# Altium schematic sheet C3.0-控制传感-3.0-led灯控制模块-24.10.17.SchDoc
size A4
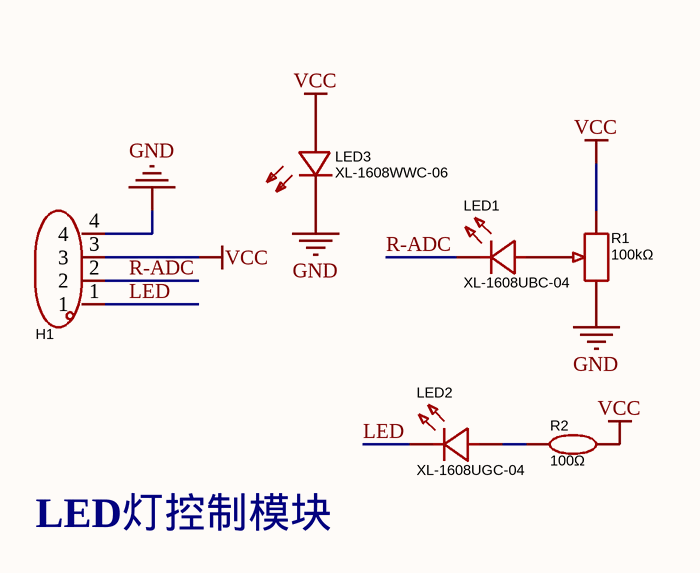
[diagram p0: C3.0-控制传感-3.0-led灯控制模块-24.10.17.SchDoc]

## Parts
H1  PZ254V-11-04P  [HDR-TH_4P-P2.54-V-M]  (value not drawn)
LED1  XL-1608UBC-04  [LED0603-RD_BLUE]
LED2  XL-1608UGC-04  [LED0603-RD_GREEN]
LED3  XL-1608WWC-06  [LED0603-RD_WHITE]
R1  100kΩ  [RES-ADJ-TH_3P-L9.5-W4.9-P2.50-L_3296W]
R2  100Ω  [R0805]

## Nets
GND: H1.4 LED3.1(C) R1.1
VCC: H1.3 LED3.2(A) R1.3 R2.2
LED: H1.1 LED2.1(K)
R-ADC: H1.2 LED1.1(K)
NetLED1_2: LED1.2(A) R1.2
NetLED2_2: LED2.2(A) R2.1

## Notes on the sheet
- LED灯控制模块

## Library data of the parts
H1 = PZ254V-11-04P: Manufacturer: XFCN(兴飞); Symbol: PZ254V-11-04P_C2691448; Add into BOM: yes; Pin Structure: 1x4P; Pitch: 2.54mm; Circluar Pins/Square Pins: 方针; Current Rating (Max): 3A; Voltage Rating (Max): 250V; Device: PZ254V-11-04P; LCSC Part Name: 间距:2.54mm 1x4P 直插 方针; Supplier Part: C2691448; Manufacturer Part: PZ254V-11-04P; Supplier Footprint: 插件,P=2.54mm; JLCPCB Part Class: Extended Part; Datasheet: https://atta.szlcsc.com/upload/public/pdf/source/20200309/C492403_F9F19131791D08044AD4F84F8E751A34.pdf; Supplier: LCSC; Convert to PCB: yes; Row Spacing: -; Mounting Type: 直插; Number of Rows: 单排; Number of Pins: 4P; Length of Mating Pin: 6mm; Insulation Height: 2.5mm; Length of End Connection Pin: 3mm; Contact Material: -; Operating Temperature Range: -40℃~+105℃; Color: 黑色; Comment_1: PZ254V-11-04P
LED1 = XL-1608UBC-04: Manufacturer: XINGLIGHT(成兴光); Add into BOM: yes; Emitted Color: 蓝色; Power Dissipation: 80mW; Forward Current: 25mA; Dominant Wavelength: 460nm~469nm; Peak Wavelength: 475nm; Lens Color: 无色透明透镜; Viewing Angle: 120°; Mounting Sytle: 正贴; Symbol: XL-1608UBC-04; Device: XL-1608UBC-04; LCSC Part Name: XL-1608UBC-04; Supplier Part: C965807; Manufacturer Part: XL-1608UBC-04; Supplier Footprint: 0603; JLCPCB Part Class: Extended Part; Datasheet: https://atta.szlcsc.com/upload/public/pdf/source/20240218/F76B043D1CDACE9DB8357580572EF0D5.pdf; Supplier: LCSC; Convert to PCB: yes; Color Temperature: -; Operating Temperature: -30℃~+85℃; Comment_1: XL-1608UBC-04
LED2 = XL-1608UGC-04: Manufacturer: XINGLIGHT(成兴光); Add into BOM: yes; Emitted Color: 翠绿色; Power Dissipation: 80mW; Forward Current: 25mA; Dominant Wavelength: 516nm~525nm; Peak Wavelength: 534nm; Diode Configuration: 独立二极管; Lens Color: 无色透明透镜; Viewing Angle: 120°; Mounting Sytle: 正贴; Symbol: XL-1608UGC-04; Device: XL-1608UGC-04; LCSC Part Name: XL-1608UGC-04; Supplier Part: C965804; Manufacturer Part: XL-1608UGC-04; Supplier Footprint: 0603; JLCPCB Part Class: Extended Part; Datasheet: https://atta.szlcsc.com/upload/public/pdf/source/20221102/520D6E465E5CFD1609C8A4DBC80D4018.pdf; Supplier: LCSC; Convert to PCB: yes; Lamp Holder Type: -; Forward Voltage (VF): -; Color Temperature: -; Luminous Intensity: -; Operating Temperature: -30℃~+85℃; Comment_1: XL-1608UGC-04
LED3 = XL-1608WWC-06: Manufacturer: XINGLIGHT(成兴光); Add into BOM: yes; Emitted Color: 白色; Forward Voltage (VF): 3.3V; Power Dissipation: 70mW; Forward Current: 20mA; Lens Color: 黄色透镜; Luminous Intensity: 780mcd; Viewing Angle: 130°; Mounting Sytle: 正贴; Symbol: xl-1608wwc-06; Device: XL-1608WWC-06; LCSC Part Name: XL-1608WWC-06; Supplier Part: C965810; Manufacturer Part: XL-1608WWC-06; Supplier Footprint: 0603; JLCPCB Part Class: Extended Part; Datasheet: https://atta.szlcsc.com/upload/public/pdf/source/20241017/E3273F0496529BA22A77FC6EB389D0BD.pdf; Supplier: LCSC; Convert to PCB: yes; Dominant Wavelength: -; Color Temperature: -; Operating Temperature: -20℃~+85℃; Comment_1: XL-1608WWC-06
R1 = 3296W-1-104: Manufacturer: BOCHEN(博晨); Add into BOM: yes; Tolerance: ±10%; Symbol: 3296W-1-104; Device: 3296W-1-104; LCSC Part Name: 100kΩ ±10%; Supplier Part: C118963; Manufacturer Part: 3296W-1-104; Supplier Footprint: 插件; JLCPCB Part Class: Extended Part; Datasheet: https://atta.szlcsc.com/upload/public/pdf/source/20171114/C118963_15106326662041117450.pdf; Supplier: LCSC; Convert to PCB: yes; Value: 100kΩ; Comment_1: 100kΩ
R2 = 0805W8F1000T5E: Manufacturer: UNI-ROYAL(厚声); Add into BOM: yes; Tolerance: ±1%; Power(Watts): 125mW; Overload Voltage (Max): 150V; Temperature Coefficient: ±100ppm/℃; Symbol: 0805W8F1000T5E; Device: 0805W8F1000T5E; LCSC Part Name: 100Ω ±1% 125mW 厚膜电阻; Supplier Part: C17408; Manufacturer Part: 0805W8F1000T5E; Supplier Footprint: 0805; JLCPCB Part Class: Basic Part; Datasheet: https://atta.szlcsc.com/upload/public/pdf/source/20200306/C422600_1E6D84923E4A46A82E41ADD87F860B5C.pdf; Supplier: LCSC; Convert to PCB: yes; Type: 厚膜电阻; Value: 100Ω; Operating Temperature Range: -55℃~+155℃; Comment_1: 100Ω